# EAGLE design DEV-IN-BASIC v1-2 (EAGLE 7.7.0)
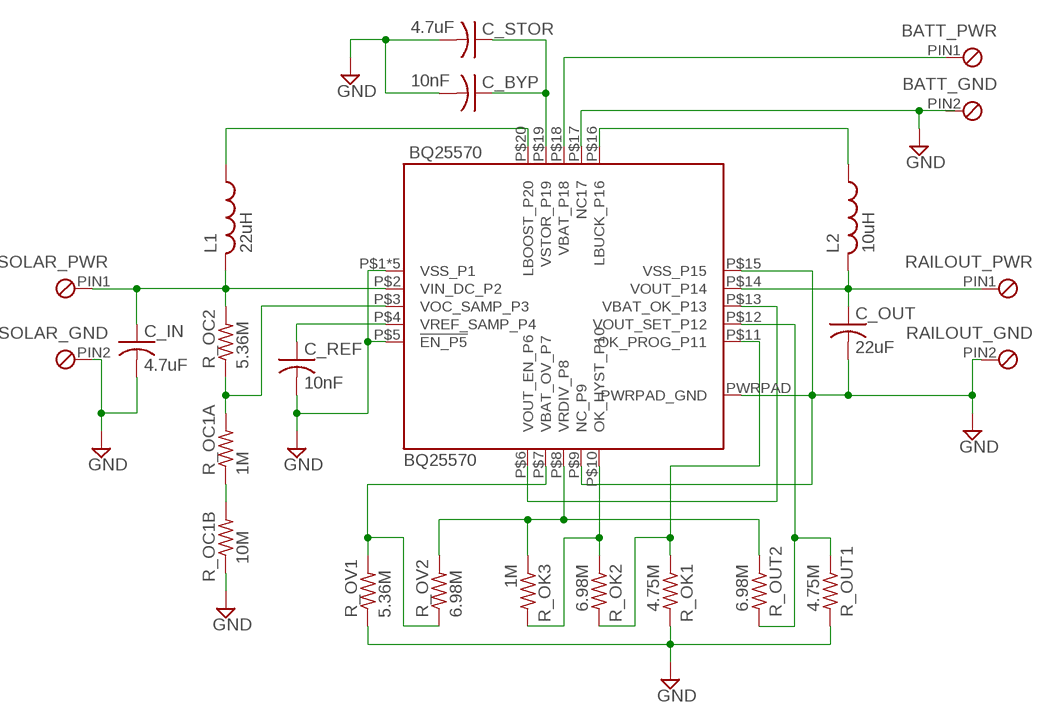
[diagram p0: schematic, sheet 1]

## Parts
BATT_  TE_2PIN_CLARK  [TE_CONN_2POS]
BQ25570  BQ25570  [BQ25570]
C_BYP  10nF  C-USC0603  [C0603]
C_IN  4.7uF  C-USC0603  [C0603]
C_OUT  22uF  C-USC0603  [C0603]
C_REF  10nF  C-USC0603  [C0603]
C_STOR  4.7uF  C-USC0603  [C0603]
L1  22uH  744031220  [744031220]
L2  10uH  744031100  [744031220]
R_OC1A  1M  R-US_R0603  [R0603]
R_OC1B  10M  R-US_R0603  [R0603]
R_OC2  5.36M  R-US_R0603  [R0603]
R_OK1  4.75M  R-US_R0603  [R0603]
R_OK2  6.98M  R-US_R0603  [R0603]
R_OK3  1M  R-US_R0603  [R0603]
R_OUT1  4.75M  R-US_R0603  [R0603]
R_OUT2  6.98M  R-US_R0603  [R0603]
R_OV1  5.36M  R-US_R0603  [R0603]
R_OV2  6.98M  R-US_R0603  [R0603]
RAILOUT_  TE_2PIN_CLARK  [TE_CONN_2POS]
SOLAR_  TE_2PIN_CLARK  [TE_CONN_2POS]

## Nets
GND: BATT_.PIN2 BQ25570.P$1(VSS_P1) BQ25570.P$5(!EN_P5) BQ25570.P$9(NC_P9) BQ25570.P$15(VSS_P15) BQ25570.P$17(NC17) BQ25570.P$21(VSS_P1) BQ25570.P$22(VSS_P1) BQ25570.P$23(VSS_P1) BQ25570.P$24(VSS_P1) BQ25570.PWRPAD(PWRPAD_GND) C_BYP.2 C_IN.2 C_OUT.2 C_REF.2 C_STOR.2 R_OC1B.1 R_OK1.2 R_OUT1.2 R_OV1.1 RAILOUT_.PIN2 SOLAR_.PIN2
LBOOST_PIN20: BQ25570.P$20(LBOOST_P20) L1.PIN1
LBUCK_PIN16: BQ25570.P$16(LBUCK_P16) L2.PIN1
N$55: R_OC1A.1 R_OC1B.2
OK_HYST_PIN10: BQ25570.P$10(OK_HYST_P10) R_OK2.1 R_OK3.2
OK_PROG_PIN11: BQ25570.P$11(OK_PROG_P11) R_OK1.1 R_OK2.2
RAILOUT_POS: BQ25570.P$14(VOUT_P14) C_OUT.1 L2.PIN2 RAILOUT_.PIN1
SOLAR_PWR_VIN: BQ25570.P$2(VIN_DC_P2) C_IN.1 L1.PIN2 R_OC2.2 SOLAR_.PIN1
VBAT: BATT_.PIN1 BQ25570.P$18(VBAT_P18)
VBAT_OK: BQ25570.P$6(VOUT_EN_P6) BQ25570.P$13(VBAT_OK_P13)
VBAT_OV_PIN7: BQ25570.P$7(VBAT_OV_P7) R_OV1.2 R_OV2.1
VOC_SAMP_PIN3: BQ25570.P$3(VOC_SAMP_P3) R_OC1A.2 R_OC2.1
VOUT_SET_PIN12: BQ25570.P$12(VOUT_SET_P12) R_OUT1.1 R_OUT2.2
VRDIV_PIN8: BQ25570.P$8(VRDIV_P8) R_OK3.1 R_OUT2.1 R_OV2.2
VREF_SAMP_PIN4: BQ25570.P$4(VREF_SAMP_P4) C_REF.1
VSTOR: BQ25570.P$19(VSTOR_P19) C_BYP.1 C_STOR.1

## Library data of the parts
BATT_ RAILOUT_ SOLAR_ = con-TE_CLARK:TE_2PIN_CLARK
BQ25570 = 00_PF_Nordic:BQ25570; MFG_PART#: BQ25570RGRR
C_BYP C_REF = resistor:C-US: CAPACITOR, American symbol; MFG_PART#: CL10B103KB8SFNC; PERCENTAGE: 10%
C_IN C_STOR = resistor:C-US: CAPACITOR, American symbol; MFG_PART#: CL10A475KQ8NNWC; PERCENTAGE: 5%
C_OUT = resistor:C-US: CAPACITOR, American symbol; MFG_PART#: GRM188R60J226MEA0D; PERCENTAGE: 20%
L1 = 00_PF_Nordic:744031220: Wurth inductor 22uH; MFG_PART#: 744031220; PERCENTAGE: 30%
L2 = 00_PFLib_12-7-2015:744031100: Wurth inductor 10uH; MFG_PART#: 744031100; PERCENTAGE: 30%
R_OC1A R_OK3 = resistor:R-US_: RESISTOR, American symbol; MFG_PART#: RMCF0603FT1M00; PERCENTAGE: 1%
R_OC1B = resistor:R-US_: RESISTOR, American symbol; MFG_PART#: RC0603FR-0710ML; PERCENTAGE: 1%
R_OC2 R_OV1 = resistor:R-US_: RESISTOR, American symbol; MFG_PART#: CRCW06035M36FKEA; PERCENTAGE: 1%
R_OK1 R_OUT1 = resistor:R-US_: RESISTOR, American symbol; MFG_PART#: RC0603FR-074M75L; PERCENTAGE: 1%
R_OK2 R_OUT2 R_OV2 = resistor:R-US_: RESISTOR, American symbol; MFG_PART#: CRCW06036M98FKEA; PERCENTAGE: 1%

## Board
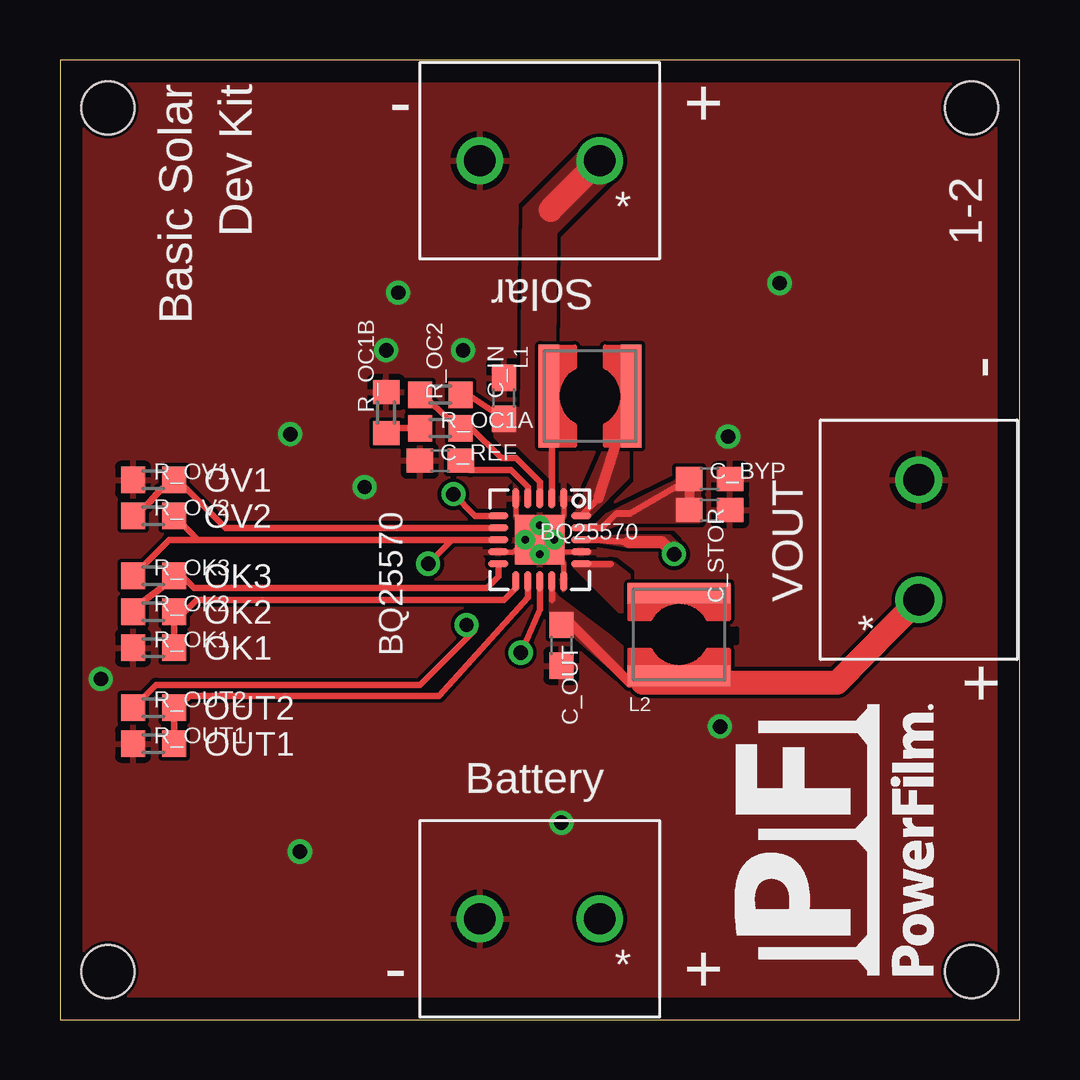
[diagram p1: board, top side]
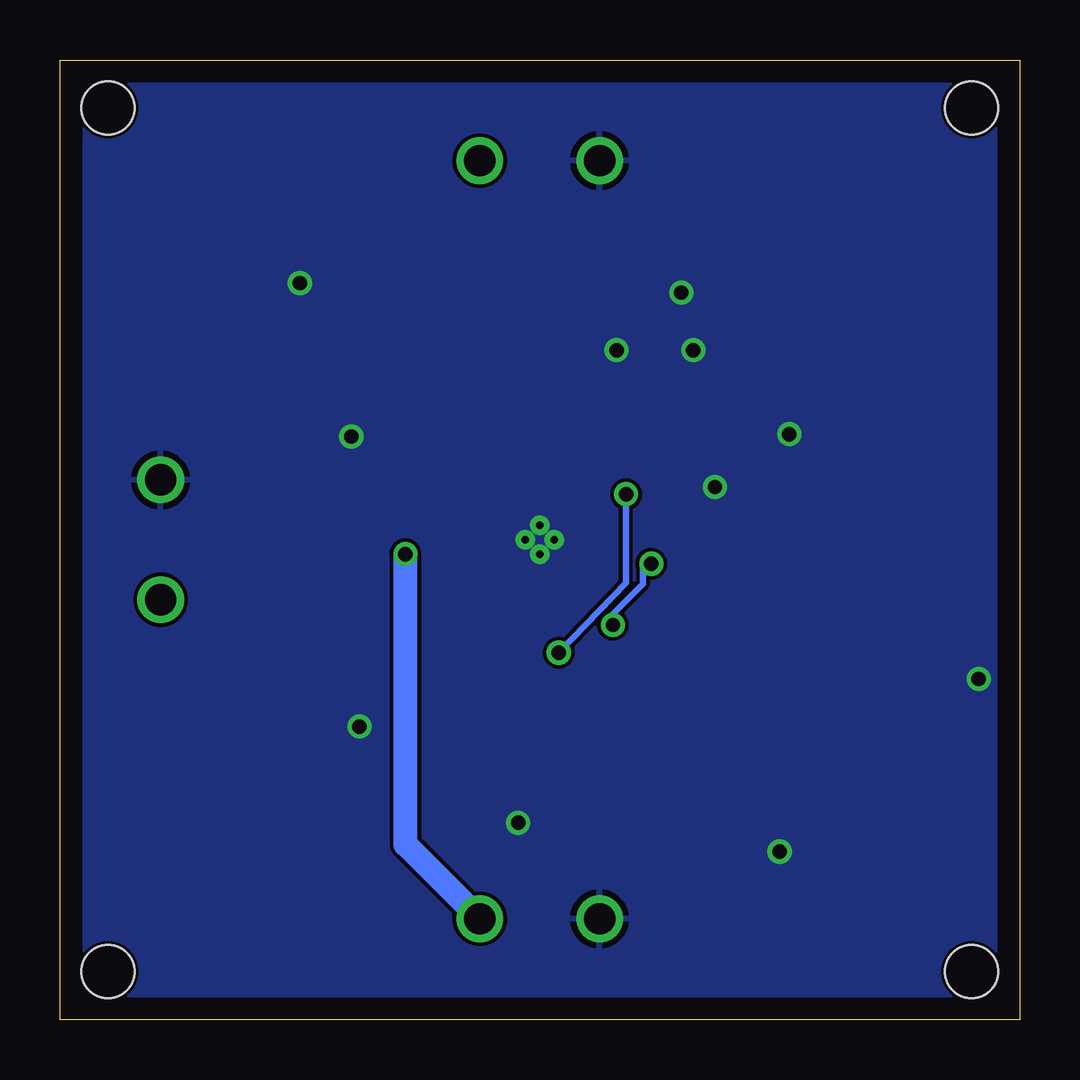
[diagram p2: board, bottom side, seen from below]

Size 40 x 40 mm. Coordinates in mm from the lower left corner, seen from the top.
Outline: 0,0 40,0 40,40 0,40 0,0
Copper layers (1*16): Top 0.035mm / dielectric 1.5mm / Bottom 0.035mm
Design rules "default *": minimum track width 6mil, minimum drill 11mil, track to track 6mil, track to pad 6mil, pad to pad 6mil, via to via 6mil, smd to smd 6mil, copper to edge 6mil, drill to drill 6mil, minimum pad ring 10mil, minimum via ring 8mil, stop-mask expansion 4mil, vias tented up to drill 0mil, thermal gap 10mil
Holes 2.2 mm at 2,38 2,2 38,38 38,2

### Footprints (pad centres in the part's own frame; a part is rotated, then mirrored left to right if it is on the bottom)
TE_CONN_2POS = drill 1.3: PIN1 -2.499,0; PIN2 2.499,0
BQ25570 = smd 0.85 x 0.28: P$1 -1.725,1; P$2 -1.725,0.5; P$3 -1.725,0; P$4 -1.725,-0.5; P$5 -1.725,-1; P$11 1.725,-1; P$12 1.725,-0.5; P$13 1.725,0; P$14 1.725,0.5; P$15 1.725,1 | smd 0.28 x 0.85: P$6 -1,-1.725; P$7 -0.5,-1.725; P$8 0,-1.725; P$9 0.5,-1.725; P$10 1,-1.725; P$16 1,1.725; P$17 0.5,1.725; P$18 0,1.725; P$19 -0.5,1.725; P$20 -1,1.725 | drill 0.3 pad 0.6: P$21 0,0.6; P$22 -0.6,0; P$23 0,-0.6; P$24 0.6,0 | smd 2.05 x 2.05: PWRPAD 0,0
C0603 = smd 1.1 x 1: 1 -0.85,0; 2 0.85,0
744031220 = smd 4.3 x 0.85: PIN1 0,1.725; PIN2 0,-1.725
R0603 = smd 1 x 1.1: 1 -0.85,0; 2 0.85,0

### Placement (x,y rotation side)
BATT_  20,4.2 180 top
BQ25570  20,20 270 top
C_BYP  27.08,22.53 0 top
C_IN  18.5,25.9 90 top
C_OUT  20.9,15.6 270 top
C_REF  15.85,23.3 180 top
C_STOR  27.08,21.23 0 top
L1  22.09,25.98 270 top
L2  25.81,16.05 0 top
R_OC1A  15.85,24.65 0 top
R_OC1B  13.6,25.3 270 top
R_OC2  15.85,26.05 0 top
R_OK1  3.9,15.5 180 top
R_OK2  3.9,17 0 top
R_OK3  3.9,18.5 0 top
R_OUT1  3.9,11.5 180 top
R_OUT2  3.9,13 0 top
R_OV1  3.9,22.5 0 top
R_OV2  3.9,21 0 top
RAILOUT_  35.8,20 90 top
SOLAR_  20,35.8 180 top

### Tracks (layer width: path | path; a pad name or v marks a point on that pad's centre or on a via)
GND  (via drill 0.6)
  Top 0.203: BQ25570.P$5 19,21.03 19.3,20.73 19.87,20.32 BQ25570.P$22 20.13,20.52 20.93,20.93 21,21 BQ25570.P$1 | BQ25570.P$17 20.73,19.5 20.73,19.51 | BQ25570.P$15 21,19 BQ25570.PWRPAD | BQ25570.P$9 18.9,19.5 BQ25570.P$23
  other vias: 9.6,24.4 13.6,27.9 16.8,27.9 12.7,22.2 1.7,14.2 27.52,12.21 20.9,8.2 27.85,24.3 30,30.7 10,7 14.1,30.3
  pour Bottom: 1,39 39,39 39,1 1,1
  pour Top (rank 3): 1,39 39,39 39,1 1,1
  pour Bottom (no thermals): 22,22 22,18 18,18 18,22
  pour Top (rank 3): 22.6,22.4 22.6,17.5 17.6,17.5 17.6,22.4
  cutout Top: 23.8,15.7 21.09,17.7 21.34,18.51 23.77,16.26 28.2,16.3 28.2,15.7
  cutout Top: 22.5,23.8 21.7,23.8 21.7,28 22.5,28
LBOOST_PIN20
  Top 0.28: BQ25570.P$20 22.45,21.73
  Top 0.406: 22.45,21.73 L1.PIN1
  pour Top (no thermals): 22,21 23.62,22.62 23.62,24.9 22.2,24.9 22.81,23.92 21.5,21
LBUCK_PIN16
  Top 0.28: BQ25570.P$16 22.95,19
  pour Top (no thermals): 21.4,19 23,19 24.7,17.7 23.7,16.7
N$55
  Top 0.28: R_OC1A.1 13.8,24.65 R_OC1B.2
OK_HYST_PIN10
  Top 0.28: BQ25570.P$10 18.27,18.48 17.8,18 5.6,18 5.1,18.5 R_OK3.2 4.45,18.15 3.35,17.35 R_OK2.1
OK_PROG_PIN11
  Top 0.28: BQ25570.P$11 19,18 18.5,17.5 5.7,17.5 5.2,17 R_OK2.2 R_OK1.1
RAILOUT_POS
  Top 0.28: BQ25570.P$14 20.5,17.5
  Top 0.406: L2.PIN2 24.3,14.33 24.3,14.05 23.75,14.05 21.13,16.66 20.93,16.46
  Top 1: 24.3,14.05 32.4,14.05 RAILOUT_.PIN1
  pour Top (no thermals): 20.5,17.8 20.5,17 21.3,16.1 21.4,16.1 24.15,13.7 24.4,14.6 22.9,15.9 20.8,17.5
SOLAR_PWR_VIN
  Top 0.28: BQ25570.P$2 20.5,23.85 | C_IN.1 18.65,24.95 17.1,26 16.75,26 R_OC2.2
  Top 1: SOLAR_.PIN1 20.45,33.75
  pour Top (no thermals): 20.6,32.8 20.5,22.6 19.1,24 18.5,24 18.2,24.3 18.2,25.4 19.3,25.4 19.4,33.8 22.1,36.5 23.2,35.4
VBAT  (via drill 0.6)
  Top 0.28: BQ25570.P$18 22.4,20 23.7,19.9
  Top 0.5: 23.7,19.9 25.1,19.9 v25.6,19.4
  Bottom 1: BATT_.PIN1 25.6,7.3 v25.6,19.4
  pour Top: 22.4,20 23.3,20.1 25.4,20.1 25.7,19.8 23.6,19.8
VBAT_OK  (via drill 0.6)
  Top 0.28: BQ25570.P$6 17.3,21 v16.4,21.9 | BQ25570.P$13 20,17.1 v19.21,15.29
  Bottom 0.28: v19.21,15.29 16.4,18.2 v16.4,21.9
VBAT_OV_PIN7
  Top 0.28: R_OV2.1 3.05,21.05 3.6,21.4 4.2,22.1 R_OV1.2 5,22.25 5.15,22.25 6.9,20.5 BQ25570.P$7
VOC_SAMP_PIN3
  Top 0.28: BQ25570.P$3 20,22.4 19,23.4 18.4,23.4 17.1,24.7 16.75,24.7 R_OC1A.2 16.45,24.8 15.25,25.9 R_OC2.1 15.15,26.05
VOUT_SET_PIN12
  Top 0.28: BQ25570.P$12 19.5,17.6 15.81,13.5 5.41,13.5 R_OUT2.2 R_OUT1.1
VRDIV_PIN8  (via drill 0.6 pad 1)
  Top 0.28: BQ25570.P$8 16.35,20 | 16.35,20 5.75,20 | 5.75,20 R_OV2.2 | R_OK3.1 4.55,20 5.75,20 | v15.35,19 16.35,20 | R_OUT2.1 4,13.95 15,13.95 17.25,16.2 v16.95,16.45 16.8,16.7
  Bottom 0.28: v15.35,19 15.7,19.1 15.7,18.15 17.15,16.7 v16.95,16.45
VREF_SAMP_PIN4
  Top 0.28: BQ25570.P$4 19.5,22.2 18.8,22.9 17.1,22.9 C_REF.1
VSTOR
  Top 0.28: C_BYP.1 23.75,21.1 23.2,21.1 22.6,20.5 BQ25570.P$19
  Top 0.406: C_BYP.1 C_STOR.1
  pour Top (no thermals): 22.6,20.5 23.5,20.8 26.62,20.8 26.62,21.5 26.58,22.83 22.8,21 22.3,20.5

### Text on the board
tPlace: Basic Solar | Dev Kit | - | + | 1-2 | Solar | - | VOUT | OV1 | BQ25570 | OV2 | OK3 | OK2 | OK1 | + | OUT2 | OUT1 | Battery | - | +
Document: PowerFilm Solar | Low Light Indoor Kit | LLDEV-1 | SOLAR+ | Vout- | SOLAR- | Vout+ | BATT+ | BATT-
201bmp: C:/Users/sjones.POWERFILM/Documents/Projects/Nordic/BLE Demo Unit/Labels/PowerFilm Logo Stacked blk wht.bmp